# EAGLE board XMICRO BP8 (EAGLE 6.3), part 1 of 2
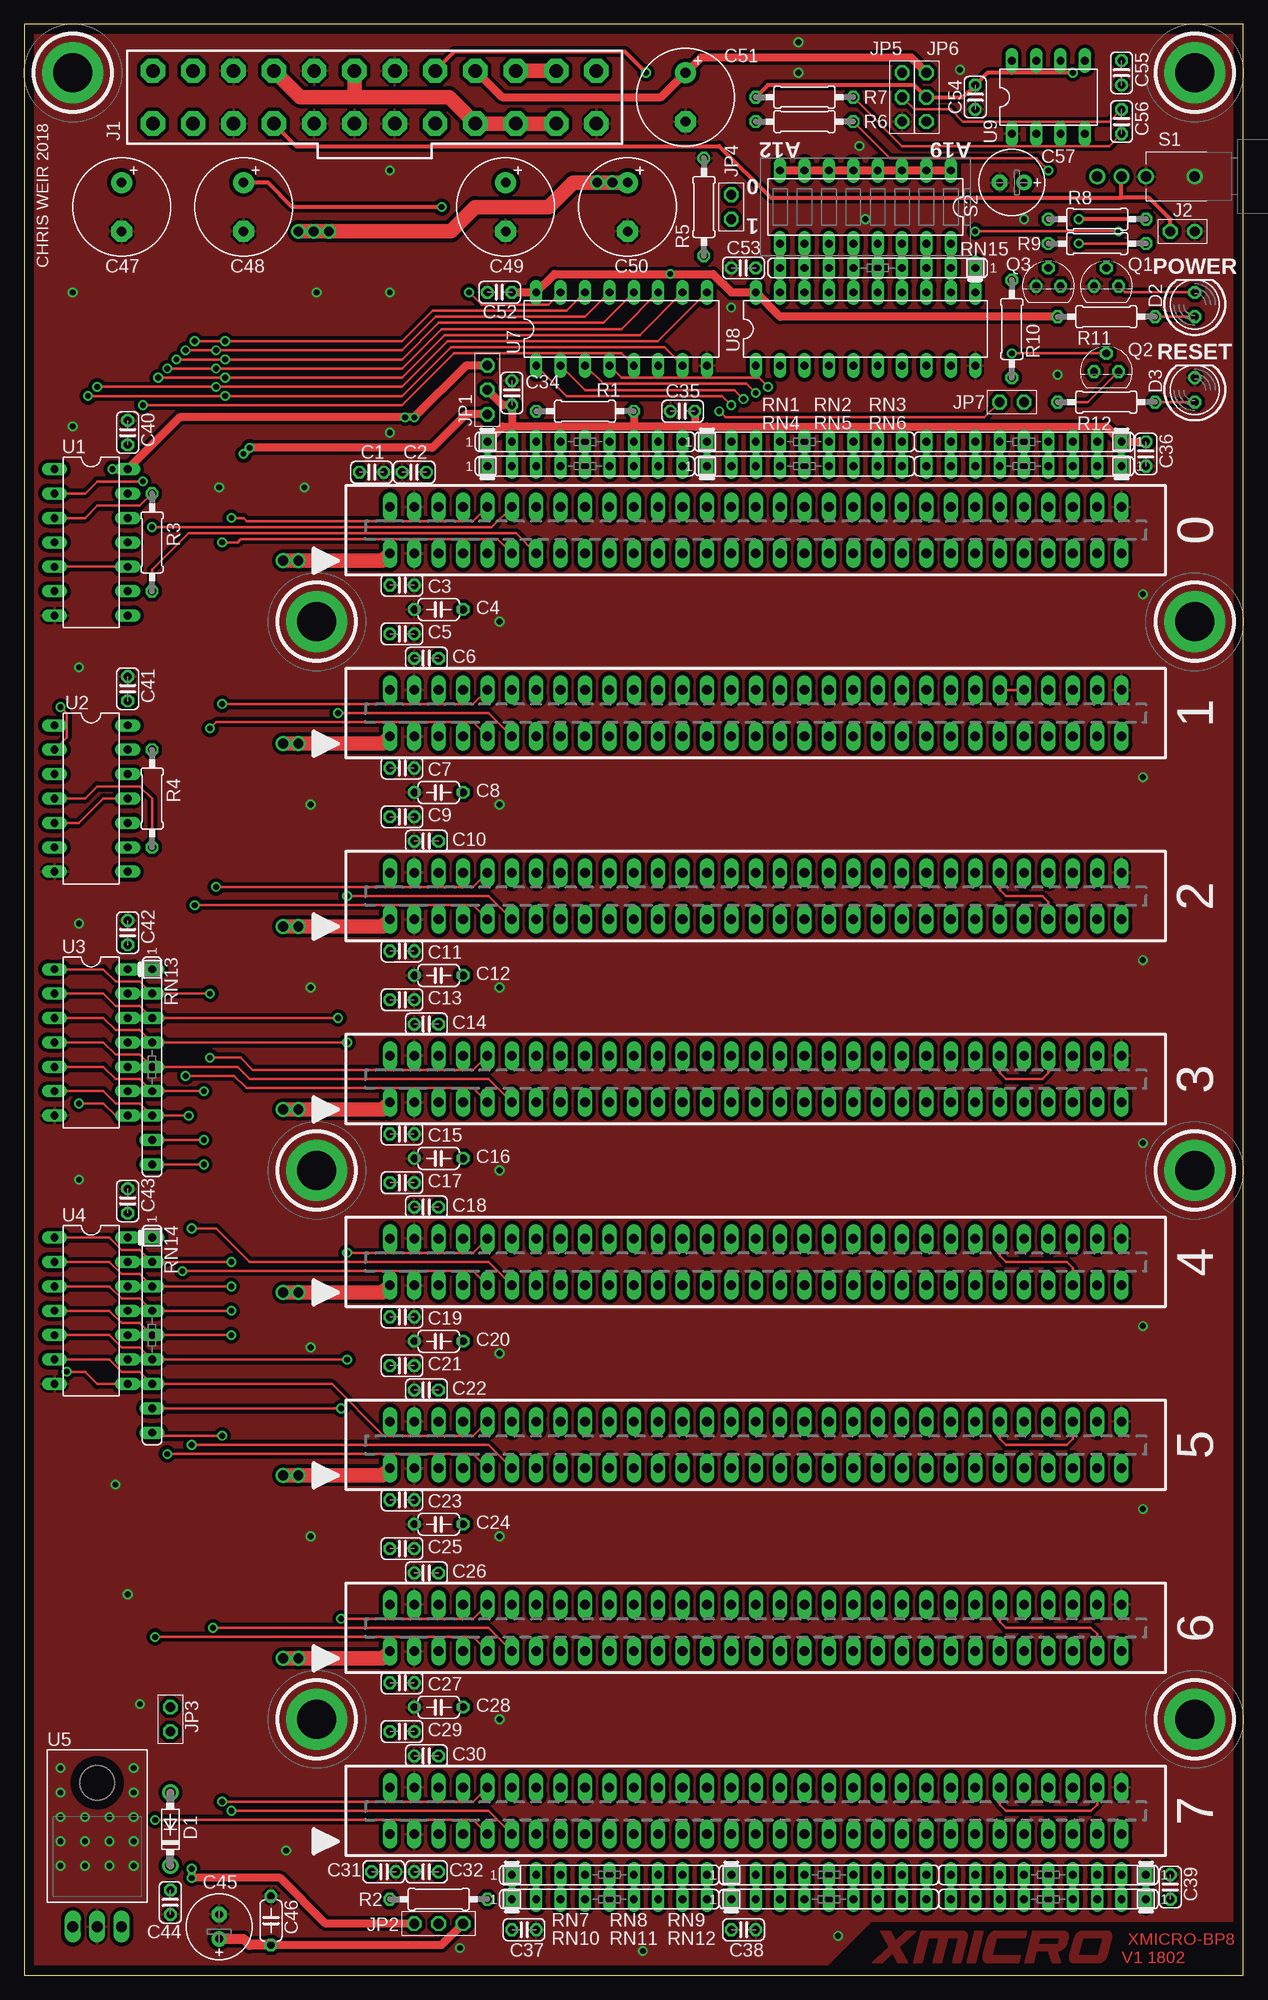
[diagram p5: board, top side]
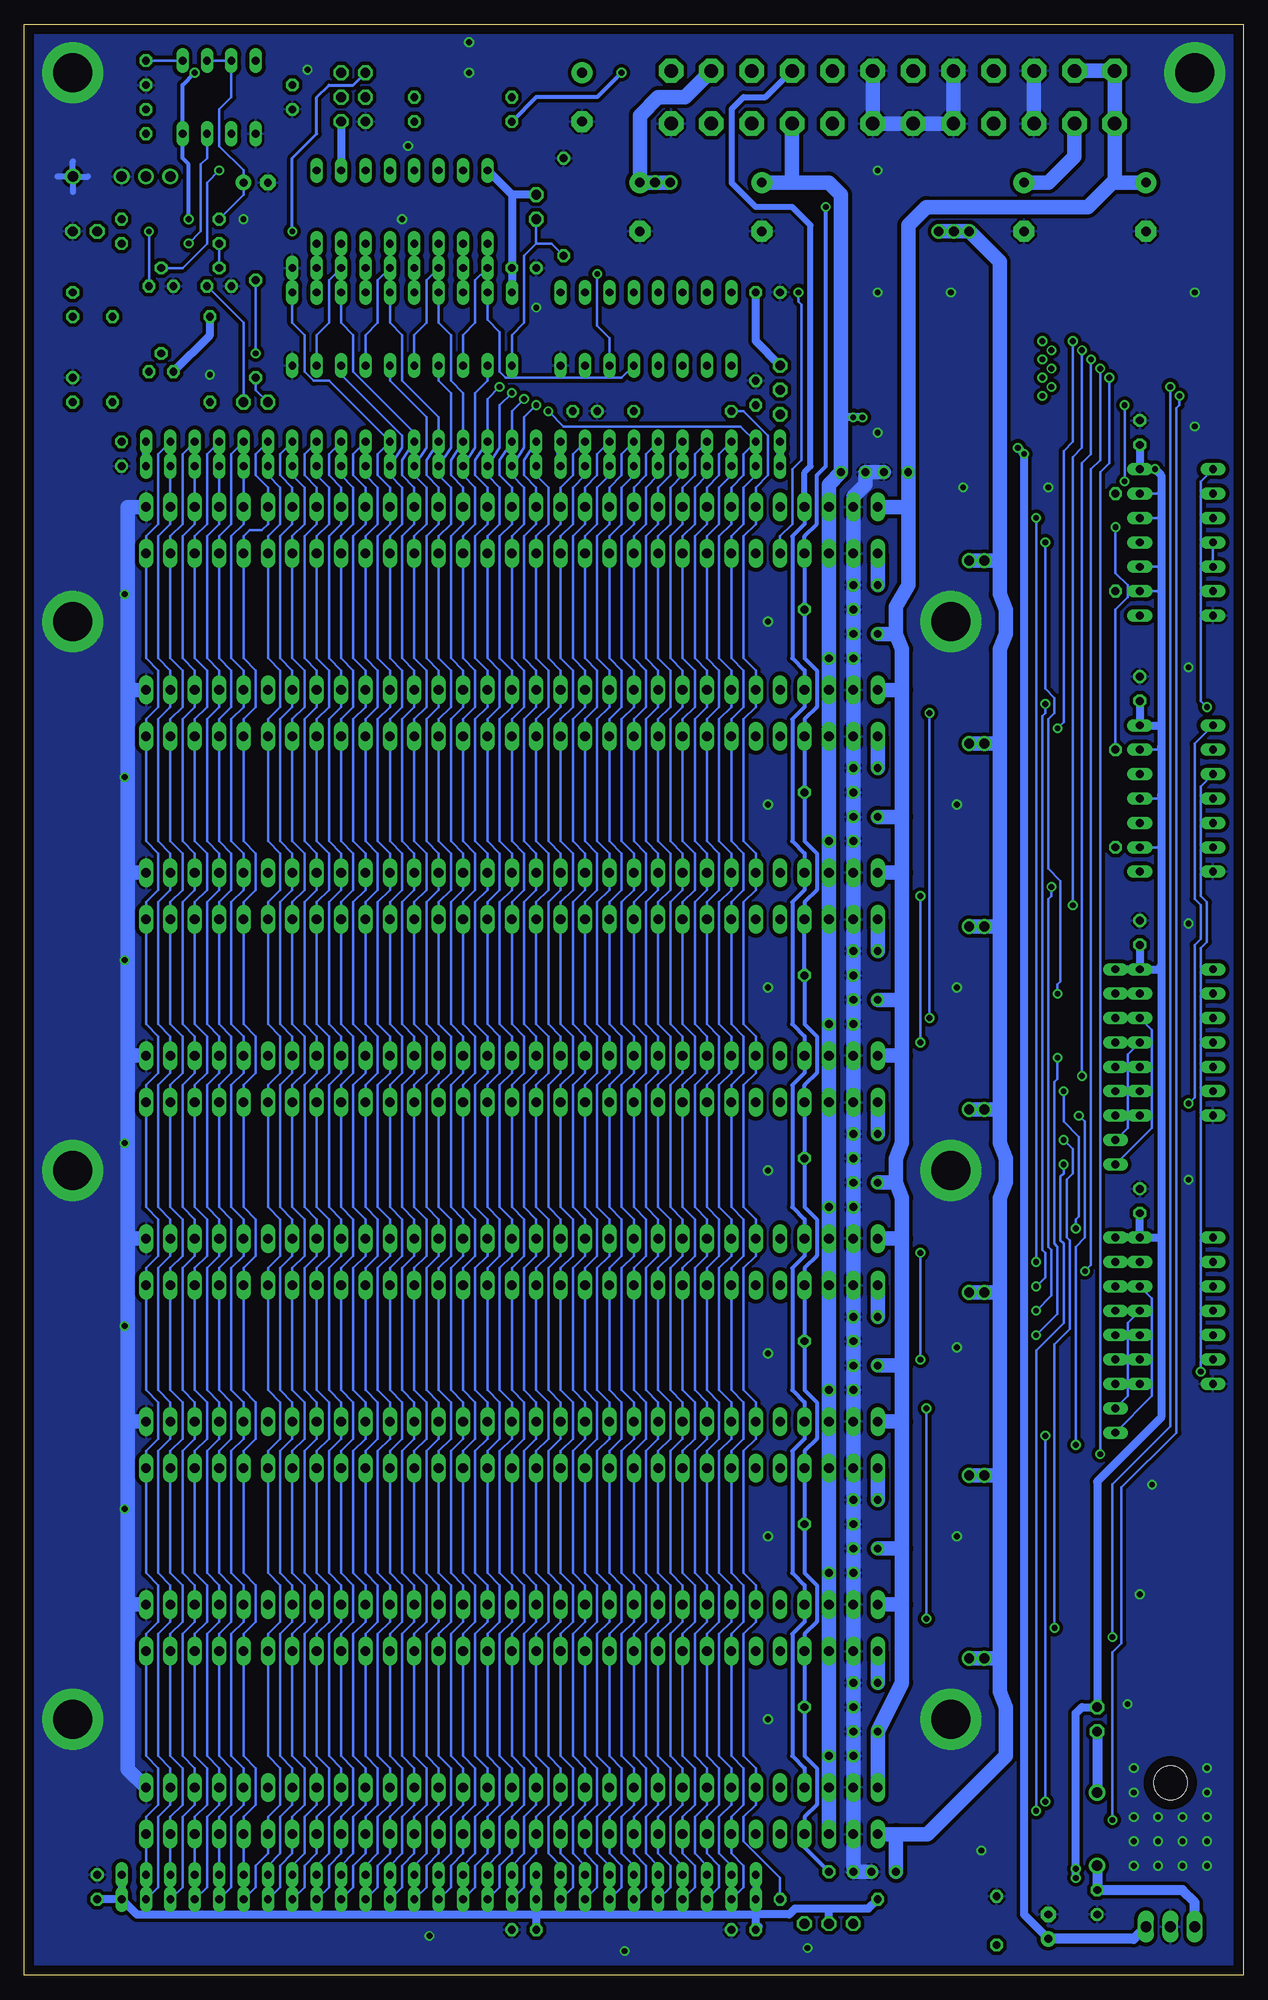
[diagram p6: board, bottom side, seen from below]

Size 127 x 203.2 mm. Coordinates in mm from the lower left corner, seen from the top.
Outline: 0,0 127,0 127,203.2 0,203.2 0,0
Copper layers (1*16): Top 0.03048125mm / dielectric 62mil / Bottom 0.03048125mm
Design rules "EasyEDA Conservative *": minimum track width 10mil, minimum drill 20mil, track to track 12mil, track to pad 12mil, pad to pad 12mil, via to via 12mil, smd to smd 8mil, copper to edge 40mil, drill to drill 10mil, minimum pad ring 10mil, minimum via ring 8mil, stop-mask expansion 4mil, vias tented up to drill 50mil, thermal gap 10mil
Net classes: 1 GND: width 0.254 mm, clearance 0.381 mm
tKeepout: area 30.2,182.9 to 42.9,189.2
bRestrict: area 121,186.4 to 122.9,188.3

## Footprints (pad centres in the part's own frame; a part is rotated, then mirrored left to right if it is on the bottom)
EDGE62F = drill 1.016 long: 1 -38.1,-2.426; 2 -38.1,2.426; 3 -35.56,-2.426; 4 -35.56,2.426; 5 -33.02,-2.426; 6 -33.02,2.426; 7 -30.48,-2.426; 8 -30.48,2.426; 9 -27.94,-2.426; 10 -27.94,2.426; 11 -25.4,-2.426; 12 -25.4,2.426; 13 -22.86,-2.426; 14 -22.86,2.426; 15 -20.32,-2.426; 16 -20.32,2.426; 17 -17.78,-2.426; 18 -17.78,2.426; 19 -15.24,-2.426; 20 -15.24,2.426; 21 -12.7,-2.426; 22 -12.7,2.426; 23 -10.16,-2.426; 24 -10.16,2.426; 25 -7.62,-2.426; 26 -7.62,2.426; 27 -5.08,-2.426; 28 -5.08,2.426; 29 -2.54,-2.426; 30 -2.54,2.426; 31 0,-2.426; 32 0,2.426; 33 2.54,-2.426; 34 2.54,2.426; 35 5.08,-2.426; 36 5.08,2.426; 37 7.62,-2.426; 38 7.62,2.426; 39 10.16,-2.426; 40 10.16,2.426; 41 12.7,-2.426; 42 12.7,2.426; 43 15.24,-2.426; 44 15.24,2.426; 45 17.78,-2.426; 46 17.78,2.426; 47 20.32,-2.426; 48 20.32,2.426; 49 22.86,-2.426; 50 22.86,2.426; 51 25.4,-2.426; 52 25.4,2.426; 53 27.94,-2.426; 54 27.94,2.426; 55 30.48,-2.426; 56 30.48,2.426; 57 33.02,-2.426; 58 33.02,2.426; 59 35.56,-2.426; 60 35.56,2.426; 61 38.1,-2.426; 62 38.1,2.426
C025-024X044 = drill 0.813 octagon: 1 -1.27,0; 2 1.27,0
C050-024X044 = drill 0.813 octagon: 1 -2.54,0; 2 2.54,0
E2,5-7 = drill 0.813 pad 1.6: + -1.27,0 | drill 0.813 pad 1.6 octagon: - 1.27,0
C-10-5 = drill 1.016 pad 2.184: + -2.54,0 | drill 1.016 pad 2.184 octagon: - 2.54,0
DO41-7.6 = drill 1.1 pad 1.7: A 3.81,0; C -3.81,0
LED5MM = drill 0.813 octagon: A -1.27,0; K 1.27,0
ATX24 = drill 1.4 pad 2.54 octagon: 1 23.1,-2.75; 2 18.9,-2.75; 3 14.7,-2.75; 4 10.5,-2.75; 5 6.3,-2.75; 6 2.1,-2.75; 7 -2.1,-2.75; 8 -6.3,-2.75; 9 -10.5,-2.75; 10 -14.7,-2.75; 11 -18.9,-2.75; 12 -23.1,-2.75; 13 23.1,2.75; 14 18.9,2.75; 15 14.7,2.75; 16 10.5,2.75; 17 6.3,2.75; 18 2.1,2.75; 19 -2.1,2.75; 20 -6.3,2.75; 21 -10.5,2.75; 22 -14.7,2.75; 23 -18.9,2.75; 24 -23.1,2.75
1X02 = drill 1.016 octagon: 1 -1.27,0; 2 1.27,0
1X03 = drill 1.016 octagon: 1 -2.54,0; 2 0,0; 3 2.54,0
TO92 = drill 0.813 octagon: 1 -1.27,0; 2 0,1.905; 3 1.27,0
0207/10 = drill 0.813 octagon: 1 -5.08,0; 2 5.08,0
SIL9 = drill 0.813 long: 1 -10.16,0; 2 -7.62,0; 3 -5.08,0; 4 -2.54,0; 5 0,0; 6 2.54,0; 7 5.08,0; 8 7.62,0; 9 10.16,0
T411013 = drill 1.1: P$1 5.08,0; P$2 7.62,0; P$3 10.16,0; P$4 0,0
SW-DIP8 = drill 0.813 long: 1 -8.89,-3.81; 2 -6.35,-3.81; 3 -3.81,-3.81; 4 -1.27,-3.81; 5 1.27,-3.81; 6 3.81,-3.81; 7 6.35,-3.81; 8 8.89,-3.81; 9 8.89,3.81; 10 6.35,3.81; 11 3.81,3.81; 12 1.27,3.81; 13 -1.27,3.81; 14 -3.81,3.81; 15 -6.35,3.81; 16 -8.89,3.81
DIL14 = drill 0.813 long: 1 -7.62,-3.81; 2 -5.08,-3.81; 3 -2.54,-3.81; 4 0,-3.81; 5 2.54,-3.81; 6 5.08,-3.81; 7 7.62,-3.81; 8 7.62,3.81; 9 5.08,3.81; 10 2.54,3.81; 11 0,3.81; 12 -2.54,3.81; 13 -5.08,3.81; 14 -7.62,3.81
TO220H = drill 1.118 long: 1 -2.54,-10.16; 2 0,-10.16; 3 2.54,-10.16 | hole 3.5: 0,4.826
DIL16 = drill 0.813 long: 1 -8.89,-3.81; 2 -6.35,-3.81; 3 -3.81,-3.81; 4 -1.27,-3.81; 5 1.27,-3.81; 6 3.81,-3.81; 7 6.35,-3.81; 8 8.89,-3.81; 9 8.89,3.81; 10 6.35,3.81; 11 3.81,3.81; 12 1.27,3.81; 13 -1.27,3.81; 14 -3.81,3.81; 15 -6.35,3.81; 16 -8.89,3.81
DIL20 = drill 0.813 long: 1 -11.43,-3.81; 2 -8.89,-3.81; 3 -6.35,-3.81; 4 -3.81,-3.81; 5 -1.27,-3.81; 6 1.27,-3.81; 7 3.81,-3.81; 8 6.35,-3.81; 9 8.89,-3.81; 10 11.43,-3.81; 11 11.43,3.81; 12 8.89,3.81; 13 6.35,3.81; 14 3.81,3.81; 15 1.27,3.81; 16 -1.27,3.81; 17 -3.81,3.81; 18 -6.35,3.81; 19 -8.89,3.81; 20 -11.43,3.81
DIL-08 = drill 0.813 long: 1 -3.81,-3.81; 2 -1.27,-3.81; 3 1.27,-3.81; 4 3.81,-3.81; 5 3.81,3.81; 6 1.27,3.81; 7 -1.27,3.81; 8 -3.81,3.81

## Placement (x,y rotation side)
0  XMICRO-BUS-PHYSICAL-EDGE62F  [EDGE62F]  76.2,150.5 0 top
1  XMICRO-BUS-PHYSICAL-EDGE62F  [EDGE62F]  76.2,131.44 0 top
2  XMICRO-BUS-PHYSICAL-EDGE62F  [EDGE62F]  76.2,112.39 0 top
3  XMICRO-BUS-PHYSICAL-EDGE62F  [EDGE62F]  76.2,93.34 0 top
4  XMICRO-BUS-PHYSICAL-EDGE62F  [EDGE62F]  76.2,74.3 0 top
5  XMICRO-BUS-PHYSICAL-EDGE62F  [EDGE62F]  76.2,55.24 0 top
6  XMICRO-BUS-PHYSICAL-EDGE62F  [EDGE62F]  76.2,36.2 0 top
7  XMICRO-BUS-PHYSICAL-EDGE62F  [EDGE62F]  76.2,17.14 0 top
C1  0.1uF  [C025-024X044]  36.2,156.53 0 top
C2  0.1uF  [C025-024X044]  40.64,156.53 180 top
C3  0.1uF  [C025-024X044]  39.37,144.78 0 top
C4  0.1uF  [C050-024X044]  43.18,142.24 180 top
C5  0.1uF  [C025-024X044]  39.37,139.7 0 top
C6  0.1uF  [C025-024X044]  41.91,137.16 180 top
C7  0.1uF  [C025-024X044]  39.37,125.73 0 top
C8  0.1uF  [C050-024X044]  43.18,123.19 180 top
C9  0.1uF  [C025-024X044]  39.37,120.65 0 top
C10  0.1uF  [C025-024X044]  41.91,118.11 180 top
C11  0.1uF  [C025-024X044]  39.37,106.68 0 top
C12  0.1uF  [C050-024X044]  43.18,104.14 180 top
C13  0.1uF  [C025-024X044]  39.37,101.6 0 top
C14  0.1uF  [C025-024X044]  41.91,99.06 180 top
C15  0.1uF  [C025-024X044]  39.37,87.63 0 top
C16  0.1uF  [C050-024X044]  43.18,85.09 180 top
C17  0.1uF  [C025-024X044]  39.37,82.55 0 top
C18  0.1uF  [C025-024X044]  41.91,80.01 180 top
C19  0.1uF  [C025-024X044]  39.37,68.58 0 top
C20  0.1uF  [C050-024X044]  43.18,66.04 180 top
C21  0.1uF  [C025-024X044]  39.37,63.5 0 top
C22  0.1uF  [C025-024X044]  41.91,60.96 180 top
C23  0.1uF  [C025-024X044]  39.37,49.53 0 top
C24  0.1uF  [C050-024X044]  43.18,46.99 180 top
C25  0.1uF  [C025-024X044]  39.37,44.45 0 top
C26  0.1uF  [C025-024X044]  41.91,41.91 180 top
C27  0.1uF  [C025-024X044]  39.37,30.48 0 top
C28  0.1uF  [C050-024X044]  43.18,27.94 180 top
C29  0.1uF  [C025-024X044]  39.37,25.4 0 top
C30  0.1uF  [C025-024X044]  41.91,22.86 180 top
C31  0.1uF  [C025-024X044]  37.47,10.79 0 top
C32  0.1uF  [C025-024X044]  41.91,10.79 180 top
C34  0.1uF  [C025-024X044]  50.8,164.78 90 top
C35  0.1uF  [C025-024X044]  68.58,162.88 180 top
C36  0.1uF  [C025-024X044]  116.84,158.43 270 top
C37  0.1uF  [C025-024X044]  52.07,4.76 0 top
C38  0.1uF  [C025-024X044]  74.93,4.76 0 top
C39  0.1uF  [C025-024X044]  119.38,9.21 90 top
C40  0.1uF  [C025-024X044]  10.79,160.66 90 top
C41  0.1uF  [C025-024X044]  10.79,133.99 90 top
C42  0.1uF  [C025-024X044]  10.79,108.58 90 top
C43  0.1uF  [C025-024X044]  10.79,80.64 90 top
C44  0.1uF  [C025-024X044]  15.24,7.62 270 top
C45  22uF 5V 1.5 Ohm ESR  [E2,5-7]  20.32,5.08 90 top
C46  0.1uF  [C050-024X044]  25.72,5.71 90 top
C47  100uF 25V  [C-10-5]  10.16,184.15 270 top
C48  220uF 10V  [C-10-5]  22.86,184.15 270 top
C49  220uF 10V  [C-10-5]  50.16,184.15 270 top
C50  100uF 25V  [C-10-5]  62.87,184.15 270 top
C51  220uF 10V  [C-10-5]  68.9,195.58 270 top
C52  0.1uF  [C025-024X044]  49.53,175.26 180 top
C53  0.1uF  [C025-024X044]  74.93,177.8 180 top
C54  0.1uF  [C025-024X044]  99.06,195.58 270 top
C55  10nF  [C025-024X044]  114.3,198.12 270 top
C56  0.1uF  [C025-024X044]  114.3,193.04 90 top
C57  10uF  [E2,5-7]  102.87,186.69 180 top
D1  1N5817-B  [DO41-7.6]  15.24,15.24 90 top
D2  [LED5MM]  121.92,173.99 90 top
D3  [LED5MM]  121.92,165.1 90 top
J1  ATX24  [ATX24]  36.51,195.58 180 top
J2  [1X02]  120.65,181.61 0 top
JP1  PINHD1X3THRU  [1X03]  48.26,165.1 270 top
JP2  PINHD1X3THRU  [1X03]  43.18,5.4 0 top
JP3  [1X02]  15.24,26.67 90 top
JP4  [1X02]  73.66,184.15 270 top
JP5  [1X03]  91.44,195.58 270 top
JP6  [1X03]  93.98,195.58 90 top
JP7  [1X02]  102.87,163.83 180 top
Q1  2N5088  [TO92]  112.71,175.9 0 top
Q2  2N4403  [TO92]  112.71,167 0 top
Q3  2N5088  [TO92]  106.68,175.9 0 top
R1  270  [0207/10]  58.42,162.88 180 top
R2  270  [0207/10]  43.18,7.94 0 top
R3  0  [0207/10]  13.34,149.22 270 top
R4  0  [0207/10]  13.34,122.56 90 top
R5  10k  [0207/10]  70.8,184.15 270 top
R6  100k  [0207/10]  81.28,193.04 0 top
R7  200k  [0207/10]  81.28,195.58 0 top
R8  47k  [0207/10]  111.76,182.88 180 top
R9  100k  [0207/10]  111.76,180.34 180 top
R10  22k  [0207/10]  102.87,171.45 90 top
R11  220  [0207/10]  112.71,172.72 180 top
R12  220  [0207/10]  112.71,163.83 180 top
RN1  270  [SIL9]  58.42,159.7 0 top
RN2  270  [SIL9]  81.28,159.7 0 top
RN3  270  [SIL9]  104.14,159.7 180 top
RN4  270  [SIL9]  58.42,157.16 0 top
RN5  270  [SIL9]  81.28,157.16 0 top
RN6  270  [SIL9]  104.14,157.16 180 top
RN7  270  [SIL9]  60.96,10.48 0 top
RN8  270  [SIL9]  83.82,10.48 0 top
RN9  270  [SIL9]  106.68,10.48 180 top
RN10  270  [SIL9]  60.96,7.94 0 top
RN11  270  [SIL9]  83.82,7.94 0 top
RN12  270  [SIL9]  106.68,7.94 180 top
RN13  3.3k  [SIL9]  13.34,94.61 270 top
RN14  3.3k  [SIL9]  13.34,66.67 270 top
RN15  10k  [SIL9]  88.9,177.8 180 top
S1  SPDTT411013  [T411013]  121.92,187.32 180 top
S2  [SW-DIP8]  87.63,184.15 180 top
U1  7408  [DIL14]  6.99,149.22 270 top
U2  7404  [DIL14]  6.99,122.56 270 top
U3  7430  [DIL14]  6.99,97.16 270 top
U4  7430  [DIL14]  6.99,69.22 270 top
U5  TL-SCSI285  [TO220H]  7.62,15.24 0 top
U7  74138  [DIL16]  62.23,171.45 0 top
U8  74688  [DIL20]  87.63,171.45 0 top
U9  555  [DIL-08]  106.68,195.58 0 top